# EAGLE design esp-01-rc-plane (EAGLE 9.5.2)
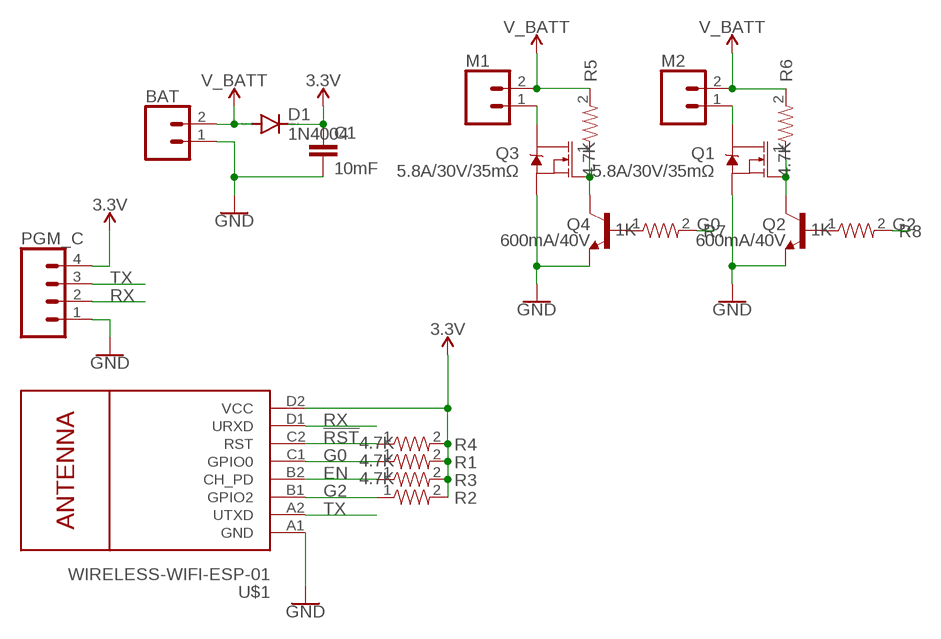
[diagram p0: schematic, sheet 1]

## Parts
BAT  CONN_02  [1X02]
C1  10mF  CAP-805  [0805]
D1  1N4004  [DO41-10]
M1  CONN_02  [1X02]
M2  CONN_02  [1X02]
PGM_C  CONN_04  [1X04]
Q1  5.8A/30V/35mΩ  MOSFET-NCH-AO3404A  [SOT23-3]
Q2  600mA/40V  TRANS_NPN-MMBT2222AL  [SOT23-3]
Q3  5.8A/30V/35mΩ  MOSFET-NCH-AO3404A  [SOT23-3]
Q4  600mA/40V  TRANS_NPN-MMBT2222AL  [SOT23-3]
R1  4.7K  RESISTOR-805  [0805]
R2  4.7K  RESISTOR-805  [0805]
R3  4.7K  RESISTOR-805  [0805]
R4  4.7K  RESISTOR-805  [0805]
R5  4.7K  RESISTOR-805  [0805]
R6  4.7K  RESISTOR-805  [0805]
R7  1K  RESISTOR-805  [0805]
R8  1K  RESISTOR-805  [0805]
U$1  WIRELESS-WIFI-ESP-01  [WIRELESS-WIFI-ESP-01]

## Nets
3.3V: C1.1 D1.C PGM_C.4 R1.2 R2.2 R3.2 R4.2 U$1.D2(VCC)
!RST: R4.1 U$1.C2(RST)
EN: R3.1 U$1.B2(CH_PD)
G0: R1.1 R7.2 U$1.C1(GPIO0)
G2: R2.1 R8.2 U$1.B1(GPIO2)
GND: BAT.1 C1.2 PGM_C.1 Q1.2(S) Q2.2(E) Q3.2(S) Q4.2(E) U$1.A1(GND)
N$1: M1.1 Q3.3(D)
N$2: Q3.1(G) Q4.3(C) R5.1
N$5: Q1.1(G) Q2.3(C) R6.1
N$6: M2.1 Q1.3(D)
N$7: Q4.1(B) R7.1
N$8: Q2.1(B) R8.1
RX: PGM_C.2 U$1.D1(URXD)
TX: PGM_C.3 U$1.A2(UTXD)
V_BATT: BAT.2 D1.A M1.2 M2.2 R5.2 R6.2

## Library data of the parts
BAT M1 M2 = SparkFun-Connectors:CONN_02: Multi connection point. Often used as Generic Header-pin footprint for 0.1 inch spaced/style header connections On any of the 0.1 inch spaced packages, you can populate with these: Break Away Headers - Straight <https://www.sparkfun.com/products/116> (PRT-00116) Break Away Male Headers - Right Angle <https://www.sparkfun.com/products/553> (PRT-00553) Female Headers <https://www.sparkfun.com/products/115> (PRT-00115) Break Away Headers - Machine Pin <https://www.sparkfun.com/products/117> (PRT-00117) Break Away Female Headers - Swiss Machine Pin <https://www.sparkfun.com/products/743> (PRT-00743) For SCREWTERMINALS and SPRING TERMINALS visit here: Screw Terimnals on SparkFun.com <https://www.sparkfun.com/search/results?term=Screw+Terminals> (5mm/3.5mm/2.54mm spacing) This device is also useful as a general connection point to wire up your design to another part of your project. Our various solder wires solder well into these plated through hole pads. Hook-Up Wire - Assortment (Stranded, 22 AWG) <https://www.sparkfun.com/products/11375> (PRT-11375) Hook-Up Wire - Assortment (Solid Core, 22 AWG) <https://www.sparkfun.com/products/11367> (PRT-11367) View the entire wire category on our website here <https://www.sparkfun.com/categories/141> Special notes: Molex polarized connector foot print use with: PRT-08233 with associated crimp pins and housings. 2.54_SCREWTERM for use with PRT-10571. 3.5mm Screw Terminal footprints for PRT-08084 5mm Screw Terminal footprints for use with PRT-08432
C1 = myParts:CAP: Generic capacitor
D1 = diode:1N4004: DIODE general purpose rectifier, 1 A
PGM_C = SparkFun-Connectors:CONN_04: Multi connection point. Often used as Generic Header-pin footprint for 0.1 inch spaced/style header connections On any of the 0.1 inch spaced packages, you can populate with these: Break Away Headers - Straight <https://www.sparkfun.com/products/116> (PRT-00116) Break Away Male Headers - Right Angle <https://www.sparkfun.com/products/553> (PRT-00553) Female Headers <https://www.sparkfun.com/products/115> (PRT-00115) Break Away Headers - Machine Pin <https://www.sparkfun.com/products/117> (PRT-00117) Break Away Female Headers - Swiss Machine Pin <https://www.sparkfun.com/products/743> (PRT-00743) For SCREWTERMINALS and SPRING TERMINALS visit here: Screw Terimnals on SparkFun.com <https://www.sparkfun.com/search/results?term=Screw+Terminals> (5mm/3.5mm/2.54mm spacing) This device is also useful as a general connection point to wire up your design to another part of your project. Our various solder wires solder well into these plated through hole pads. Hook-Up Wire - Assortment (Stranded, 22 AWG) <https://www.sparkfun.com/products/11375> (PRT-11375) Hook-Up Wire - Assortment (Solid Core, 22 AWG) <https://www.sparkfun.com/products/11367> (PRT-11367) View the entire wire category on our website here <https://www.sparkfun.com/categories/141> Special notes: Molex polarized connector foot print use with SKU : PRT-08231 with associated crimp pins and housings. 1MM SMD Version SKU: PRT-10208; PROD_ID: CONN-09696
Q1 Q3 = SparkFun-DiscreteSemi:MOSFET-NCH: N-channel MOSFETs Voltage controlled devices that allow control of high current outputs. SparkFun Products: SparkFun OpenScale <https://www.sparkfun.com/products/13261> SparkFun Digital Sandbox <https://www.sparkfun.com/products/12651> SparkFun Monster Moto Shield <https://www.sparkfun.com/products/10182> SparkFun MOSFET Power Controller <https://www.sparkfun.com/products/11214>; PROD_ID: TRANS-12988
Q2 Q4 = SparkFun-DiscreteSemi:TRANS_NPN: NPN transistor Current controlled devices typically used to amplify current or used as a switch. BC547 - COM-08928 <http://www.sparkfun.com/products/8928> (TO-92 45V 100mA) (1.Collector 2.Base 3.Emitter) 2N3904 - COM-00521 <http://www.sparkfun.com/products/521> (TO-92 40V 200mA) (1.Emitter 2.Base 3.Collector) P2N2222A - COM-12852 <http://www.sparkfun.com/products/12852> (TO-92 40V 600mA) (1.Collector 2.Base 3.Emitter); PROD_ID: TRANS-08049
R1-R8 = myParts:RESISTOR: Generic resistor
U$1 = diy-modules:WIRELESS-WIFI-ESP-01: Wireless Wi-Fi ESP-01 Module based on ESP8266 chip Click here to find device on ebay.com <http://www.ebay.com/sch/esp8266+esp+01+transceiver>

## Board
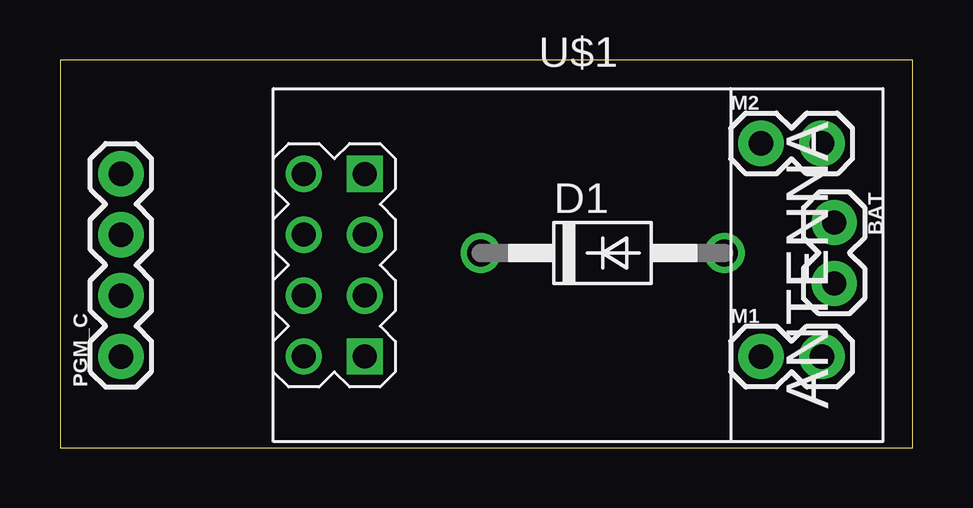
[diagram p1: board, top side]
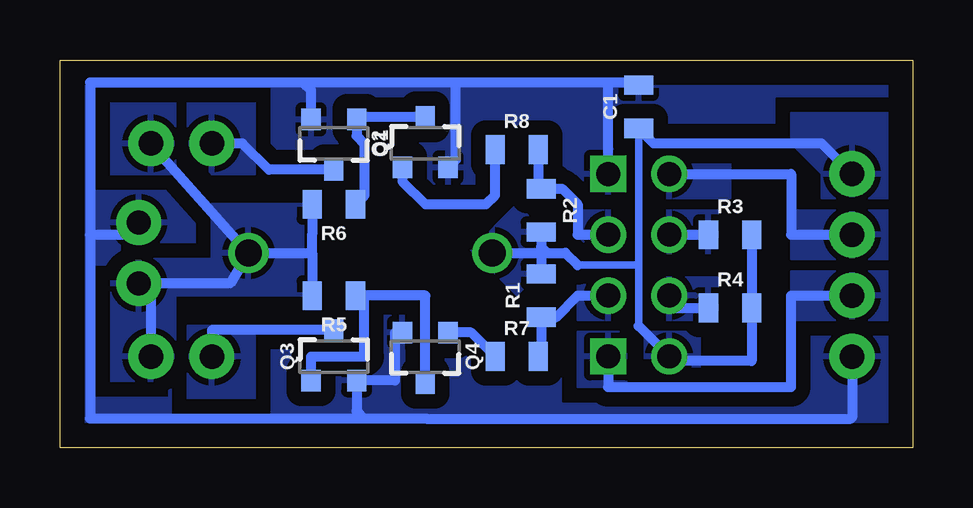
[diagram p2: board, bottom side, seen from below]

Size 35.54 x 16.18 mm. Coordinates in mm from the lower left corner, seen from the top.
Outline: 0,0 35.54,0 35.54,16.18 0,16.18 0,0
Copper layers (1*16): Top 0.035mm / dielectric 1.5mm / Bottom 0.035mm
Design rules "default": minimum track width 6mil, minimum drill 0.35mm, track to track 6mil, track to pad 6mil, pad to pad 6mil, via to via 6mil, smd to smd 6mil, copper to edge 40mil, drill to drill 6mil, minimum pad ring 10mil, minimum via ring 8mil, stop-mask expansion 4mil, vias tented up to drill 0mil, thermal gap 10mil

### Footprints (pad centres in the part's own frame; a part is rotated, then mirrored left to right if it is on the bottom)
1X02 = drill 1.016 pad 1.88: 1 0,0; 2 2.54,0
0805 = smd 0.8 x 1.2: 1 -0.9,0; 2 0.9,0
DO41-10 = drill 1.118: A 5.08,0; C -5.08,0
1X04 = drill 1.016 pad 1.88: 1 0,0; 2 2.54,0; 3 5.08,0; 4 7.62,0
SOT23-3 = smd 0.8 x 0.9: 1 -0.95,-1; 2 0.95,-1; 3 0,1.1
WIRELESS-WIFI-ESP-01 = drill 1 square: A1 -8.89,3.81; D1 -8.89,-3.81 | drill 1: A2 -11.43,3.81; B1 -8.89,1.27; B2 -11.43,1.27; C1 -8.89,-1.27; C2 -11.43,-1.27; D2 -11.43,-3.81

### Placement (x,y rotation side)
BAT  32.26,9.4 270 top
C1  11.43,14.22 90 bottom
D1  22.61,8.13 0 top
M1  29.21,3.81 0 top
M2  29.21,12.7 0 top
PGM_C  2.54,3.81 90 top
Q1  24.13,12.7 180 bottom
Q2  20.32,12.7 0 bottom
Q3  24.13,3.81 0 bottom
Q4  20.32,3.81 180 bottom
R1  15.49,6.35 90 bottom
R2  15.49,9.91 270 bottom
R3  7.62,8.89 0 bottom
R4  7.62,5.84 0 bottom
R5  24.13,6.35 180 bottom
R6  24.13,10.16 180 bottom
R7  16.51,3.81 0 bottom
R8  16.51,12.45 0 bottom
U$1  21.59,7.62 0 top

### Tracks (layer width: path | path; a pad name or v marks a point on that pad's centre or on a via)
3.3V
  Bottom 0.305: 13.97,7.62 11.43,7.62 | 11.43,7.62 11.43,5.08 | 11.43,7.62 C1.1
  Bottom 0.406: D1.C 15.24,8.13 | 15.24,8.13 14.48,8.13 13.97,7.62 | 11.43,5.08 U$1.D2 9.97,3.62 6.72,3.62 R4.2 R3.2 | C1.1 10.81,12.7 3.81,12.7 PGM_C.4 | R2.2 15.49,8.38 | 15.49,8.38 15.24,8.13 | 15.49,8.38 R1.2
  pour Bottom (isolate 0.61, rank 3): 15.24,8.89 16.51,10.16 18.41,8.26 16.51,6.35 15.24,7.62
  pour Bottom (isolate 0.61, rank 3): 8.89,4.83 11.18,4.83 11.18,3.05 8.89,3.05
  pour Bottom (isolate 0.61, rank 3): 0,13.97 5.08,13.97 5.08,12.7 3.81,11.43 3.81,10.41 0,10.41
!RST
  Bottom 0.406: U$1.C2 10.16,5.84 R4.1
  pour Bottom (isolate 0.61, rank 3): 8.13,7.11 10.92,7.11 10.92,5.33 8.13,5.33
EN
  Bottom 0.406: U$1.B2 R3.1
  pour Bottom (isolate 0.61, rank 3): 8.13,9.91 10.92,9.91 10.92,8.13 8.13,8.13
G0
  Bottom 0.406: U$1.C1 13.97,6.35 14.87,5.45 R1.1 15.49,3.93 R7.2
  pour Bottom (isolate 0.61, rank 3): 11.94,7.11 13.97,7.11 13.97,5.33 11.94,5.33
G2
  Bottom 0.406: U$1.B1 13.97,8.89 13.97,10.16 14.62,10.81 R2.1 15.61,10.92 R8.2
  pour Bottom (isolate 0.61, rank 3): 11.94,9.91 11.94,8.13 13.97,8.13 13.97,9.91
GND
  Bottom 0.406: 12.7,15.24 11.43,15.24 C1.2 | 34.29,8.89 34.29,15.24 25.4,15.24 | 34.29,8.89 34.29,1.22 22.86,1.22 | 20.32,1.22 22.86,1.22 | U$1.A1 12.7,15.24 | 34.29,8.89 32.77,8.89 BAT.1 | PGM_C.1 2.54,1.27 2.59,1.22 20.27,1.22 | 12.7,15.24 19.05,15.24 | 19.05,15.24 25.4,15.24 | Q2.2 19.05,12.02 19.05,15.24 | Q1.2 25.08,14.92 25.4,15.24 | 23.18,2.9 Q3.2 | Q3.2 23.18,1.54 22.86,1.22 | Q4.2 21.59,4.81 21.59,2.81 Q3.2
  pour Bottom (isolate 0.61, rank 5): 0,16.51 35.56,16.51 35.56,0 0,0
N$1
  Bottom 0.406: Q3.3 29.21,4.91 M1.1
  pour Bottom (isolate 0.61, rank 3): 27.43,5.08 30.23,5.08 30.23,2.03 27.43,2.03
N$2
  Bottom 0.406: Q4.3 20.32,6.35 22.86,6.35 | 22.86,6.35 R5.1 | Q3.1 25.08,3.81 22.86,3.81 22.86,6.35
N$5
  Bottom 0.406: Q2.3 23.08,13.8 Q1.1 23.18,13.02 22.86,12.7 22.86,10.53 R6.1
N$6
  Bottom 0.406: Q1.3 26.84,11.6 27.94,12.7 M2.1
  pour Bottom (isolate 0.61, rank 3): 27.43,11.43 27.43,14.48 30.23,14.48 30.23,12.45 29.21,11.43
N$7
  Bottom 0.406: R7.1 18.41,4.81 Q4.1
N$8
  Bottom 0.406: Q2.1 21.27,11.11 20.32,10.16 17.78,10.16 17.41,10.53 R8.1
RX
  Bottom 0.406: U$1.D1 12.7,2.54 5.08,2.54 5.08,6.35 PGM_C.2
  pour Bottom (isolate 0.61, rank 3): 11.94,4.83 13.97,4.83 13.97,2.54 11.94,2.54
  pour Bottom (isolate 0.61, rank 3): 0,7.37 5.08,7.37 5.08,5.33 0,5.33
TX
  Bottom 0.406: U$1.A2 5.08,11.43 5.08,8.89 PGM_C.3
  pour Bottom (isolate 0.61, rank 3): 7.62,12.19 10.92,12.19 10.92,10.41 7.62,10.41
  pour Bottom (isolate 0.61, rank 3): 0,9.91 3.81,9.91 5.08,9.91 5.08,7.87 0,7.87
V_BATT
  Bottom 0.406: D1.A 28.45,6.86 BAT.2 31.75,6.35 M1.2 | M2.2 D1.A | R6.2 25.03,8.89 25.03,8.13 | 25.03,8.13 R5.2 | D1.A 25.03,8.13
  pour Bottom (isolate 0.61, rank 3): 25.4,10.16 29.21,10.16 29.21,7.87 33.53,7.87 33.53,2.79 30.73,2.79 30.73,6.35 25.4,6.35
  pour Bottom (isolate 0.61, rank 3): 30.73,14.48 33.53,14.48 33.53,11.43 30.73,11.43